# EAGLE design piezo-layer_v0.95-R006 (EAGLE 6.5.0)
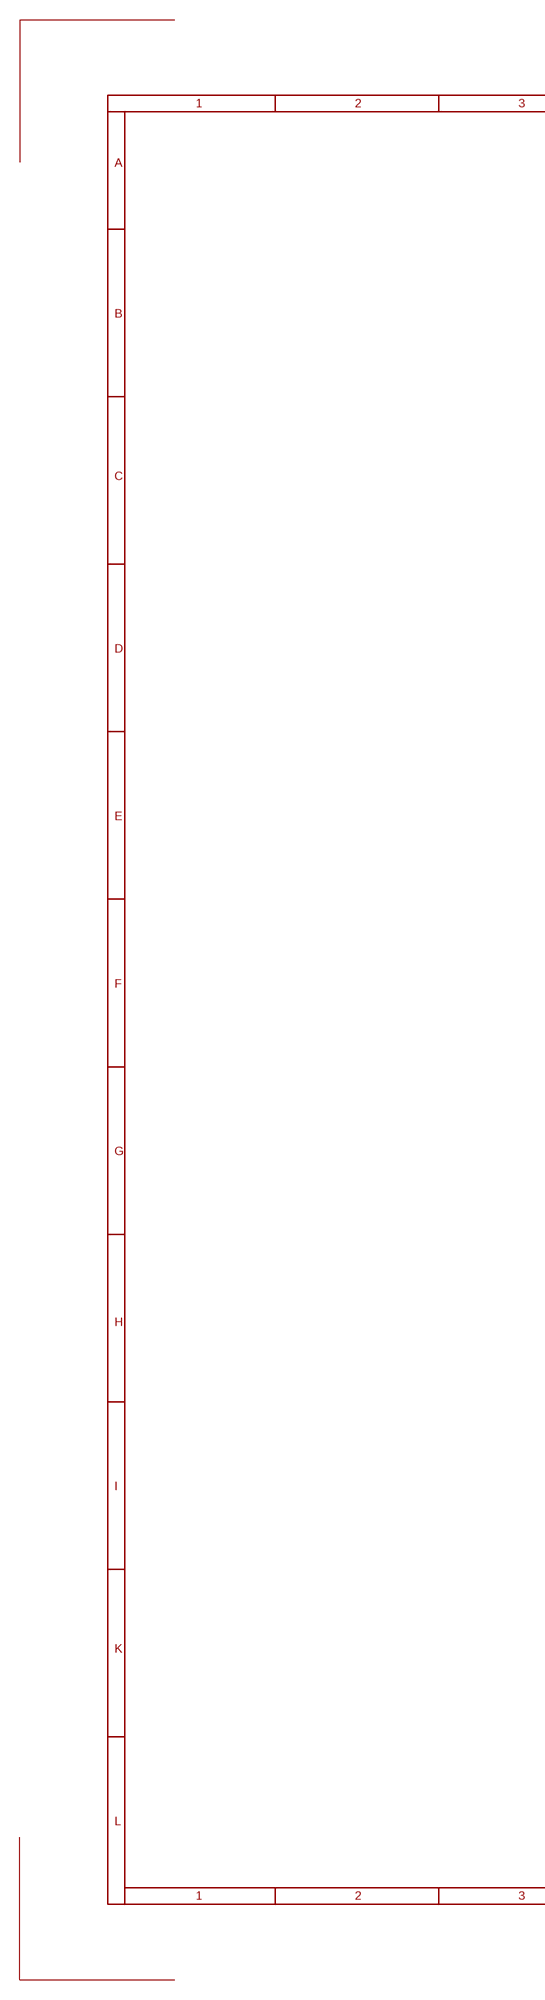
[diagram p0: schematic, sheet 1, part 1 of 2]
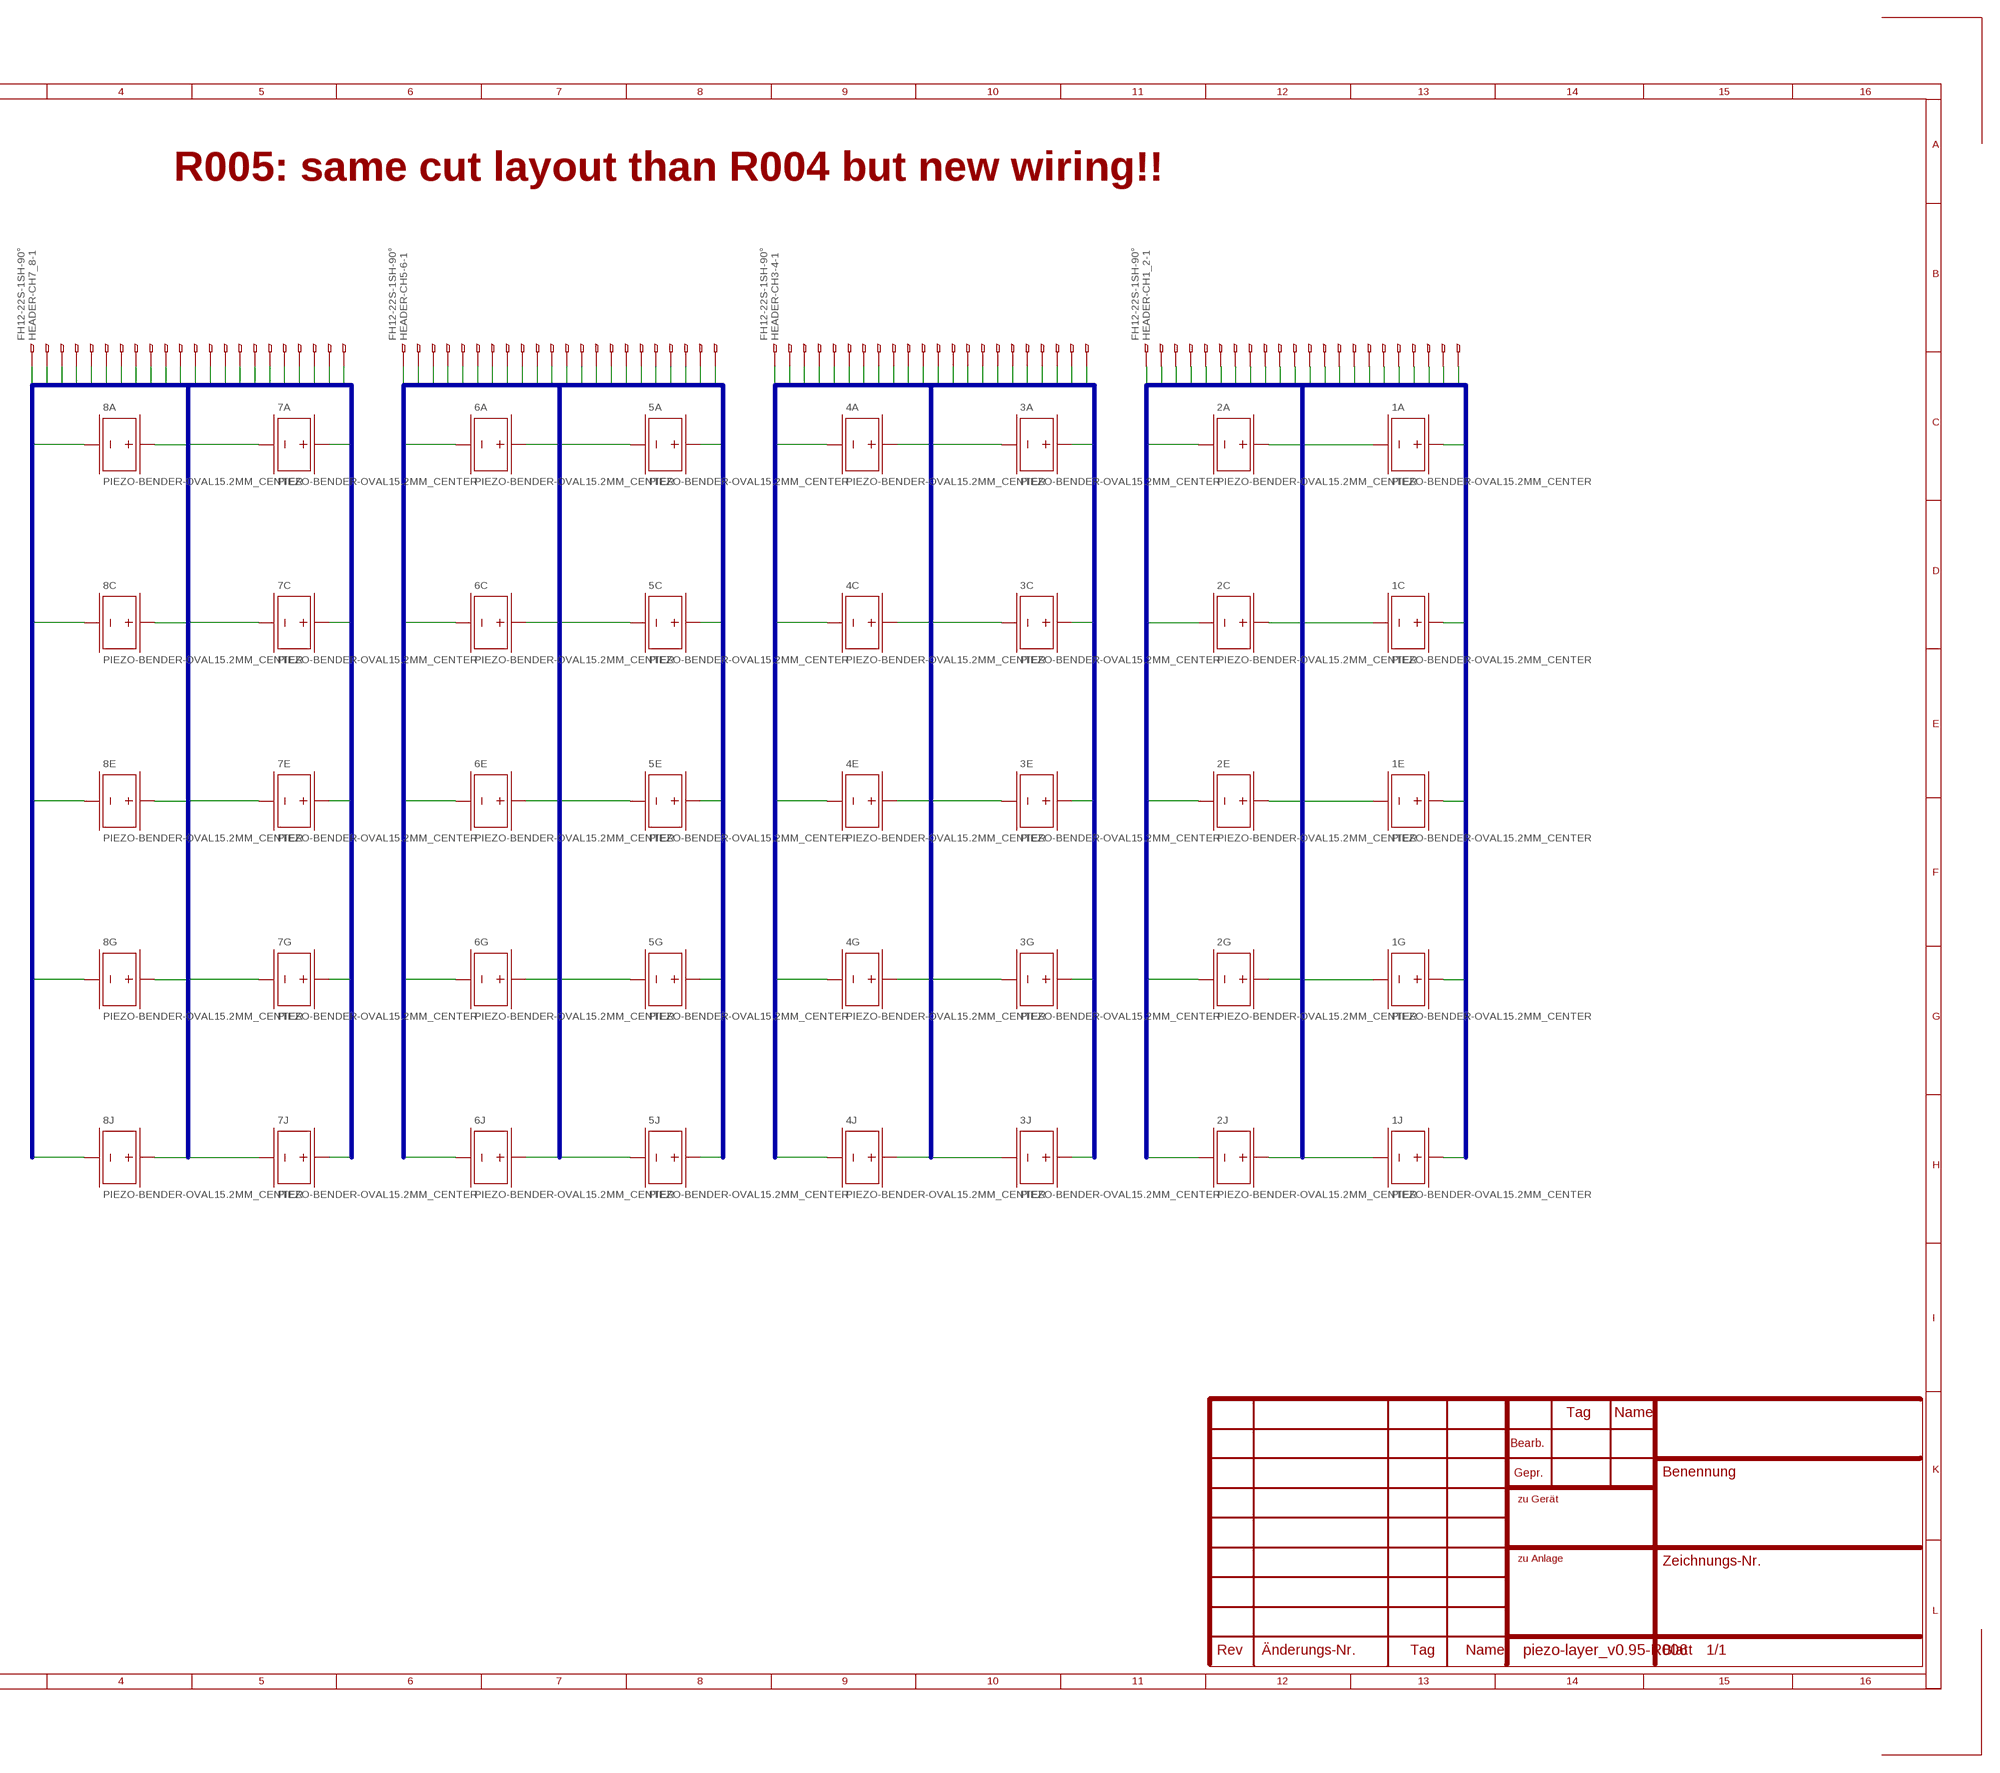
[diagram p1: schematic, sheet 1, part 2 of 2]

## Parts
1A  PIEZO-BENDER-OVAL15.2MM_CENTER  [PIEZO-BENDER-OVAL_15.2MM_BIGPADS_CENTER]
1C  PIEZO-BENDER-OVAL15.2MM_CENTER  [PIEZO-BENDER-OVAL_15.2MM_BIGPADS_CENTER]
1E  PIEZO-BENDER-OVAL15.2MM_CENTER  [PIEZO-BENDER-OVAL_15.2MM_BIGPADS_CENTER]
1G  PIEZO-BENDER-OVAL15.2MM_CENTER  [PIEZO-BENDER-OVAL_15.2MM_BIGPADS_CENTER]
1J  PIEZO-BENDER-OVAL15.2MM_CENTER  [PIEZO-BENDER-OVAL_15.2MM_BIGPADS_CENTER]
2A  PIEZO-BENDER-OVAL15.2MM_CENTER  [PIEZO-BENDER-OVAL_15.2MM_BIGPADS_CENTER]
2C  PIEZO-BENDER-OVAL15.2MM_CENTER  [PIEZO-BENDER-OVAL_15.2MM_BIGPADS_CENTER]
2E  PIEZO-BENDER-OVAL15.2MM_CENTER  [PIEZO-BENDER-OVAL_15.2MM_BIGPADS_CENTER]
2G  PIEZO-BENDER-OVAL15.2MM_CENTER  [PIEZO-BENDER-OVAL_15.2MM_BIGPADS_CENTER]
2J  PIEZO-BENDER-OVAL15.2MM_CENTER  [PIEZO-BENDER-OVAL_15.2MM_BIGPADS_CENTER]
3A  PIEZO-BENDER-OVAL15.2MM_CENTER  [PIEZO-BENDER-OVAL_15.2MM_BIGPADS_CENTER]
3C  PIEZO-BENDER-OVAL15.2MM_CENTER  [PIEZO-BENDER-OVAL_15.2MM_BIGPADS_CENTER]
3E  PIEZO-BENDER-OVAL15.2MM_CENTER  [PIEZO-BENDER-OVAL_15.2MM_BIGPADS_CENTER]
3G  PIEZO-BENDER-OVAL15.2MM_CENTER  [PIEZO-BENDER-OVAL_15.2MM_BIGPADS_CENTER]
3J  PIEZO-BENDER-OVAL15.2MM_CENTER  [PIEZO-BENDER-OVAL_15.2MM_BIGPADS_CENTER]
4A  PIEZO-BENDER-OVAL15.2MM_CENTER  [PIEZO-BENDER-OVAL_15.2MM_BIGPADS_CENTER]
4C  PIEZO-BENDER-OVAL15.2MM_CENTER  [PIEZO-BENDER-OVAL_15.2MM_BIGPADS_CENTER]
4E  PIEZO-BENDER-OVAL15.2MM_CENTER  [PIEZO-BENDER-OVAL_15.2MM_BIGPADS_CENTER]
4G  PIEZO-BENDER-OVAL15.2MM_CENTER  [PIEZO-BENDER-OVAL_15.2MM_BIGPADS_CENTER]
4J  PIEZO-BENDER-OVAL15.2MM_CENTER  [PIEZO-BENDER-OVAL_15.2MM_BIGPADS_CENTER]
5A  PIEZO-BENDER-OVAL15.2MM_CENTER  [PIEZO-BENDER-OVAL_15.2MM_BIGPADS_CENTER]
5C  PIEZO-BENDER-OVAL15.2MM_CENTER  [PIEZO-BENDER-OVAL_15.2MM_BIGPADS_CENTER]
5E  PIEZO-BENDER-OVAL15.2MM_CENTER  [PIEZO-BENDER-OVAL_15.2MM_BIGPADS_CENTER]
5G  PIEZO-BENDER-OVAL15.2MM_CENTER  [PIEZO-BENDER-OVAL_15.2MM_BIGPADS_CENTER]
5J  PIEZO-BENDER-OVAL15.2MM_CENTER  [PIEZO-BENDER-OVAL_15.2MM_BIGPADS_CENTER]
6A  PIEZO-BENDER-OVAL15.2MM_CENTER  [PIEZO-BENDER-OVAL_15.2MM_BIGPADS_CENTER]
6C  PIEZO-BENDER-OVAL15.2MM_CENTER  [PIEZO-BENDER-OVAL_15.2MM_BIGPADS_CENTER]
6E  PIEZO-BENDER-OVAL15.2MM_CENTER  [PIEZO-BENDER-OVAL_15.2MM_BIGPADS_CENTER]
6G  PIEZO-BENDER-OVAL15.2MM_CENTER  [PIEZO-BENDER-OVAL_15.2MM_BIGPADS_CENTER]
6J  PIEZO-BENDER-OVAL15.2MM_CENTER  [PIEZO-BENDER-OVAL_15.2MM_BIGPADS_CENTER]
7A  PIEZO-BENDER-OVAL15.2MM_CENTER  [PIEZO-BENDER-OVAL_15.2MM_BIGPADS_CENTER]
7C  PIEZO-BENDER-OVAL15.2MM_CENTER  [PIEZO-BENDER-OVAL_15.2MM_BIGPADS_CENTER]
7E  PIEZO-BENDER-OVAL15.2MM_CENTER  [PIEZO-BENDER-OVAL_15.2MM_BIGPADS_CENTER]
7G  PIEZO-BENDER-OVAL15.2MM_CENTER  [PIEZO-BENDER-OVAL_15.2MM_BIGPADS_CENTER]
7J  PIEZO-BENDER-OVAL15.2MM_CENTER  [PIEZO-BENDER-OVAL_15.2MM_BIGPADS_CENTER]
8A  PIEZO-BENDER-OVAL15.2MM_CENTER  [PIEZO-BENDER-OVAL_15.2MM_BIGPADS_CENTER]
8C  PIEZO-BENDER-OVAL15.2MM_CENTER  [PIEZO-BENDER-OVAL_15.2MM_BIGPADS_CENTER]
8E  PIEZO-BENDER-OVAL15.2MM_CENTER  [PIEZO-BENDER-OVAL_15.2MM_BIGPADS_CENTER]
8G  PIEZO-BENDER-OVAL15.2MM_CENTER  [PIEZO-BENDER-OVAL_15.2MM_BIGPADS_CENTER]
8J  PIEZO-BENDER-OVAL15.2MM_CENTER  [PIEZO-BENDER-OVAL_15.2MM_BIGPADS_CENTER]
HEADER-CH1_2  FH12-22S-1SH-90°  [FH12-22S-1SH]
HEADER-CH3-4  FH12-22S-1SH-90°  [FH12-22S-1SH]
HEADER-CH5-6  FH12-22S-1SH-90°  [FH12-22S-1SH]
HEADER-CH7_8  FH12-22S-1SH-90°  [FH12-22S-1SH]

## Nets
BUS1: 1J.TOP(+_1) HEADER-CH1_2.21
BUS2: HEADER-CH1_2.20
BUS3: 1G.TOP(+_1) HEADER-CH1_2.19
BUS4: HEADER-CH1_2.18
BUS5: 1A.BOTTOM(-_1) 1C.BOTTOM(-_1) 1E.BOTTOM(-_1) 1G.BOTTOM(-_1) 1J.BOTTOM(-_1) HEADER-CH1_2.16 HEADER-CH1_2.22
BUS6: 1E.TOP(+_1) HEADER-CH1_2.17
BUS7: HEADER-CH1_2.15
BUS8: 1C.TOP(+_1) HEADER-CH1_2.14
BUS9: HEADER-CH1_2.13
BUS10: 1A.TOP(+_1) HEADER-CH1_2.12
BUS11: 2J.TOP(+_1) HEADER-CH1_2.10
BUS12: HEADER-CH1_2.9
BUS13: 2G.TOP(+_1) HEADER-CH1_2.8
BUS14: HEADER-CH1_2.7
BUS15: 2A.BOTTOM(-_1) 2C.BOTTOM(-_1) 2E.BOTTOM(-_1) 2G.BOTTOM(-_1) 2J.BOTTOM(-_1) HEADER-CH1_2.5 HEADER-CH1_2.11
BUS16: 2E.TOP(+_1) HEADER-CH1_2.6
BUS17: HEADER-CH1_2.4
BUS18: 2C.TOP(+_1) HEADER-CH1_2.3
BUS19: HEADER-CH1_2.2
BUS20: 2A.TOP(+_1) HEADER-CH1_2.1
BUS21: 3J.TOP(+_1) HEADER-CH3-4.21
BUS22: HEADER-CH3-4.20
BUS23: 3G.TOP(+_1) HEADER-CH3-4.19
BUS24: HEADER-CH3-4.18
BUS25: 3A.BOTTOM(-_1) 3C.BOTTOM(-_1) 3E.BOTTOM(-_1) 3G.BOTTOM(-_1) 3J.BOTTOM(-_1) HEADER-CH3-4.16 HEADER-CH3-4.22
BUS26: 3E.TOP(+_1) HEADER-CH3-4.17
BUS27: HEADER-CH3-4.15
BUS28: 3C.TOP(+_1) HEADER-CH3-4.14
BUS29: HEADER-CH3-4.13
BUS30: 3A.TOP(+_1) HEADER-CH3-4.12
BUS31: 4J.TOP(+_1) HEADER-CH3-4.10
BUS32: HEADER-CH3-4.9
BUS33: 4G.TOP(+_1) HEADER-CH3-4.8
BUS34: HEADER-CH3-4.7
BUS35: 4A.BOTTOM(-_1) 4C.BOTTOM(-_1) 4E.BOTTOM(-_1) 4G.BOTTOM(-_1) 4J.BOTTOM(-_1) HEADER-CH3-4.5 HEADER-CH3-4.11
BUS36: 4E.TOP(+_1) HEADER-CH3-4.6
BUS37: HEADER-CH3-4.4
BUS38: 4C.TOP(+_1) HEADER-CH3-4.3
BUS39: HEADER-CH3-4.2
BUS40: 4A.TOP(+_1) HEADER-CH3-4.1
BUS41: 5J.TOP(+_1) HEADER-CH5-6.21
BUS42: HEADER-CH5-6.20
BUS43: 5G.TOP(+_1) HEADER-CH5-6.19
BUS44: HEADER-CH5-6.18
BUS45: 5A.BOTTOM(-_1) 5C.BOTTOM(-_1) 5E.BOTTOM(-_1) 5G.BOTTOM(-_1) 5J.BOTTOM(-_1) HEADER-CH5-6.16 HEADER-CH5-6.22
BUS46: 5E.TOP(+_1) HEADER-CH5-6.17
BUS47: HEADER-CH5-6.15
BUS48: 5C.TOP(+_1) HEADER-CH5-6.14
BUS49: HEADER-CH5-6.13
BUS50: 5A.TOP(+_1) HEADER-CH5-6.12
BUS51: 6J.TOP(+_1) HEADER-CH5-6.10
BUS52: HEADER-CH5-6.9
BUS53: 6G.TOP(+_1) HEADER-CH5-6.8
BUS54: HEADER-CH5-6.7
BUS55: 6A.BOTTOM(-_1) 6C.BOTTOM(-_1) 6E.BOTTOM(-_1) 6G.BOTTOM(-_1) 6J.BOTTOM(-_1) HEADER-CH5-6.5 HEADER-CH5-6.11
BUS56: 6E.TOP(+_1) HEADER-CH5-6.6
BUS57: HEADER-CH5-6.4
BUS58: 6C.TOP(+_1) HEADER-CH5-6.3
BUS59: HEADER-CH5-6.2
BUS60: 6A.TOP(+_1) HEADER-CH5-6.1
BUS61: 7J.TOP(+_1) HEADER-CH7_8.21
BUS62: HEADER-CH7_8.20
BUS63: 7G.TOP(+_1) HEADER-CH7_8.19
BUS64: HEADER-CH7_8.18
BUS65: 7A.BOTTOM(-_1) 7C.BOTTOM(-_1) 7E.BOTTOM(-_1) 7G.BOTTOM(-_1) 7J.BOTTOM(-_1) HEADER-CH7_8.16 HEADER-CH7_8.22
BUS66: 7E.TOP(+_1) HEADER-CH7_8.17
BUS67: HEADER-CH7_8.15
BUS68: 7C.TOP(+_1) HEADER-CH7_8.14
BUS69: HEADER-CH7_8.13
BUS70: 7A.TOP(+_1) HEADER-CH7_8.12
BUS71: 8J.TOP(+_1) HEADER-CH7_8.10
BUS72: HEADER-CH7_8.9
BUS73: 8G.TOP(+_1) HEADER-CH7_8.8
BUS74: HEADER-CH7_8.7
BUS75: 8A.BOTTOM(-_1) 8C.BOTTOM(-_1) 8E.BOTTOM(-_1) 8G.BOTTOM(-_1) 8J.BOTTOM(-_1) HEADER-CH7_8.5 HEADER-CH7_8.11
BUS76: 8E.TOP(+_1) HEADER-CH7_8.6
BUS77: HEADER-CH7_8.4
BUS78: 8C.TOP(+_1) HEADER-CH7_8.3
BUS79: HEADER-CH7_8.2
BUS80: 8A.TOP(+_1) HEADER-CH7_8.1

## Buses
BUS[1..20]
BUS[21..40]
BUS[41..60]
BUS[61..80]

## Notes on the sheet
- R005: same cut layout than R004 but new wiring!!

## Library data of the parts
1A 1C 1E 1G 1J 2A 2C 2E 2G 2J 3A 3C 3E 3G 3J 4A 4C 4E 4G 4J 5A 5C 5E 5G 5J 6A 6C 6E 6G 6J 7A 7C 7E 7G 7J 8A 8C 8E 8G 8J = ICST:PIEZO-BENDER-OVAL
HEADER-CH1_2 HEADER-CH3-4 HEADER-CH5-6 HEADER-CH7_8 = ICST:FH12-22S-1SH

## Board
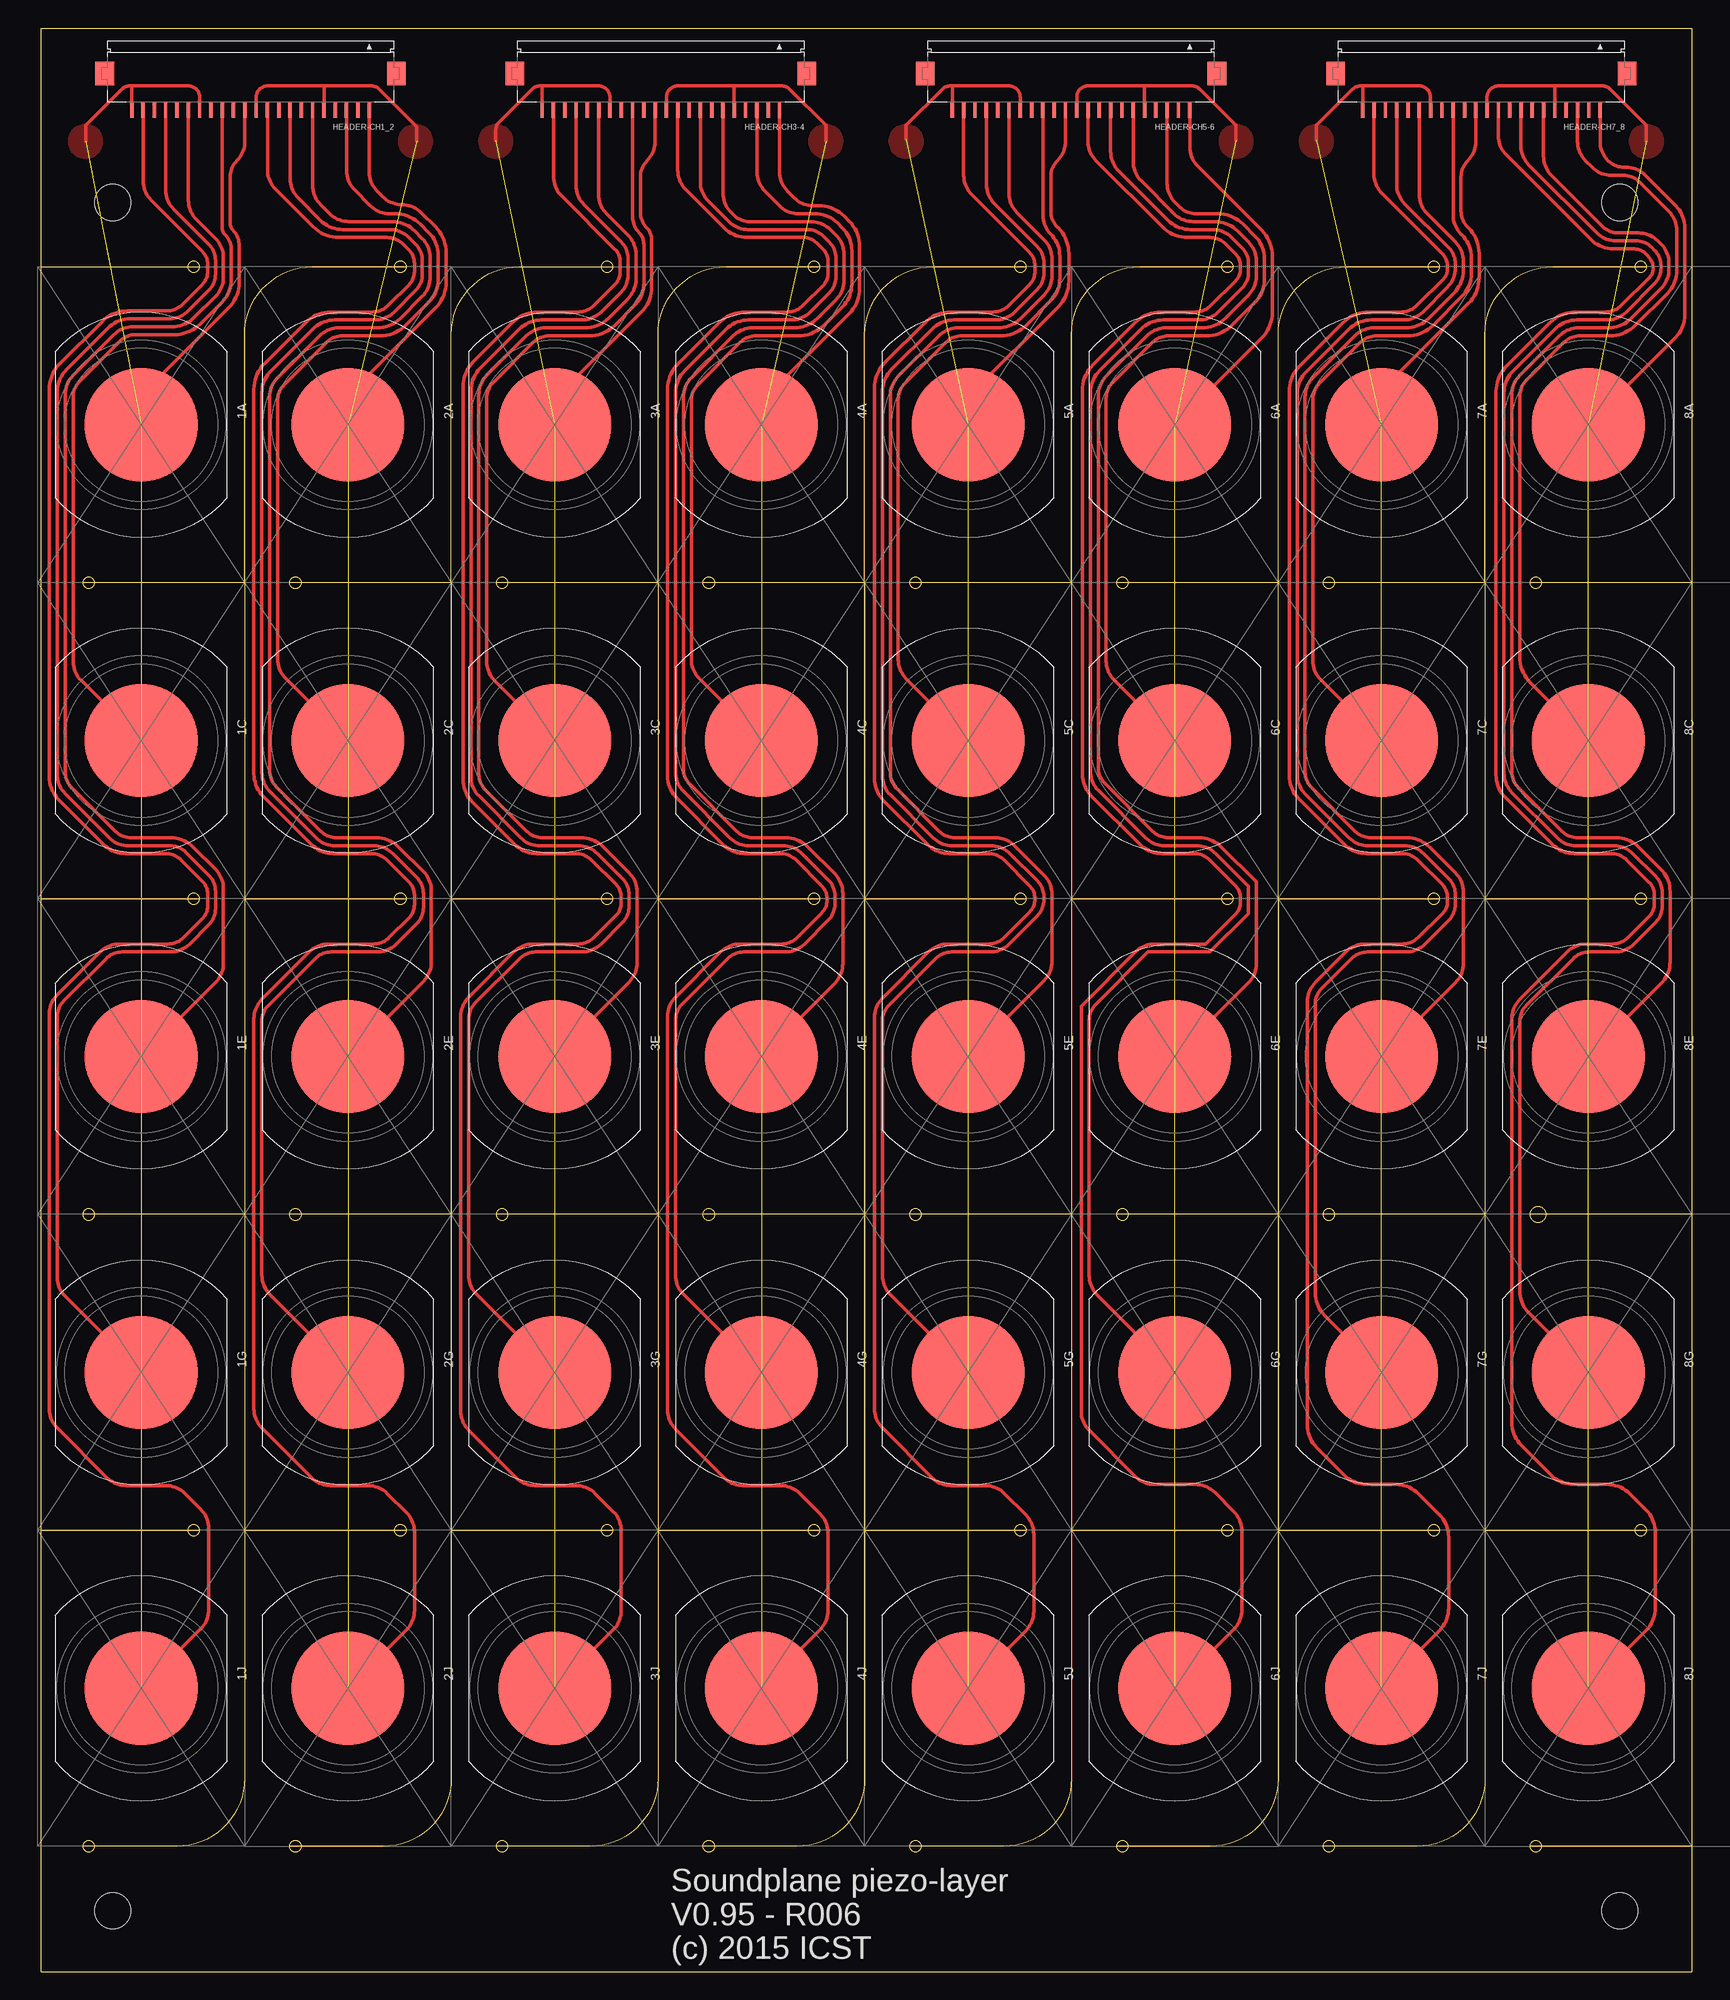
[diagram p2: board, top side]
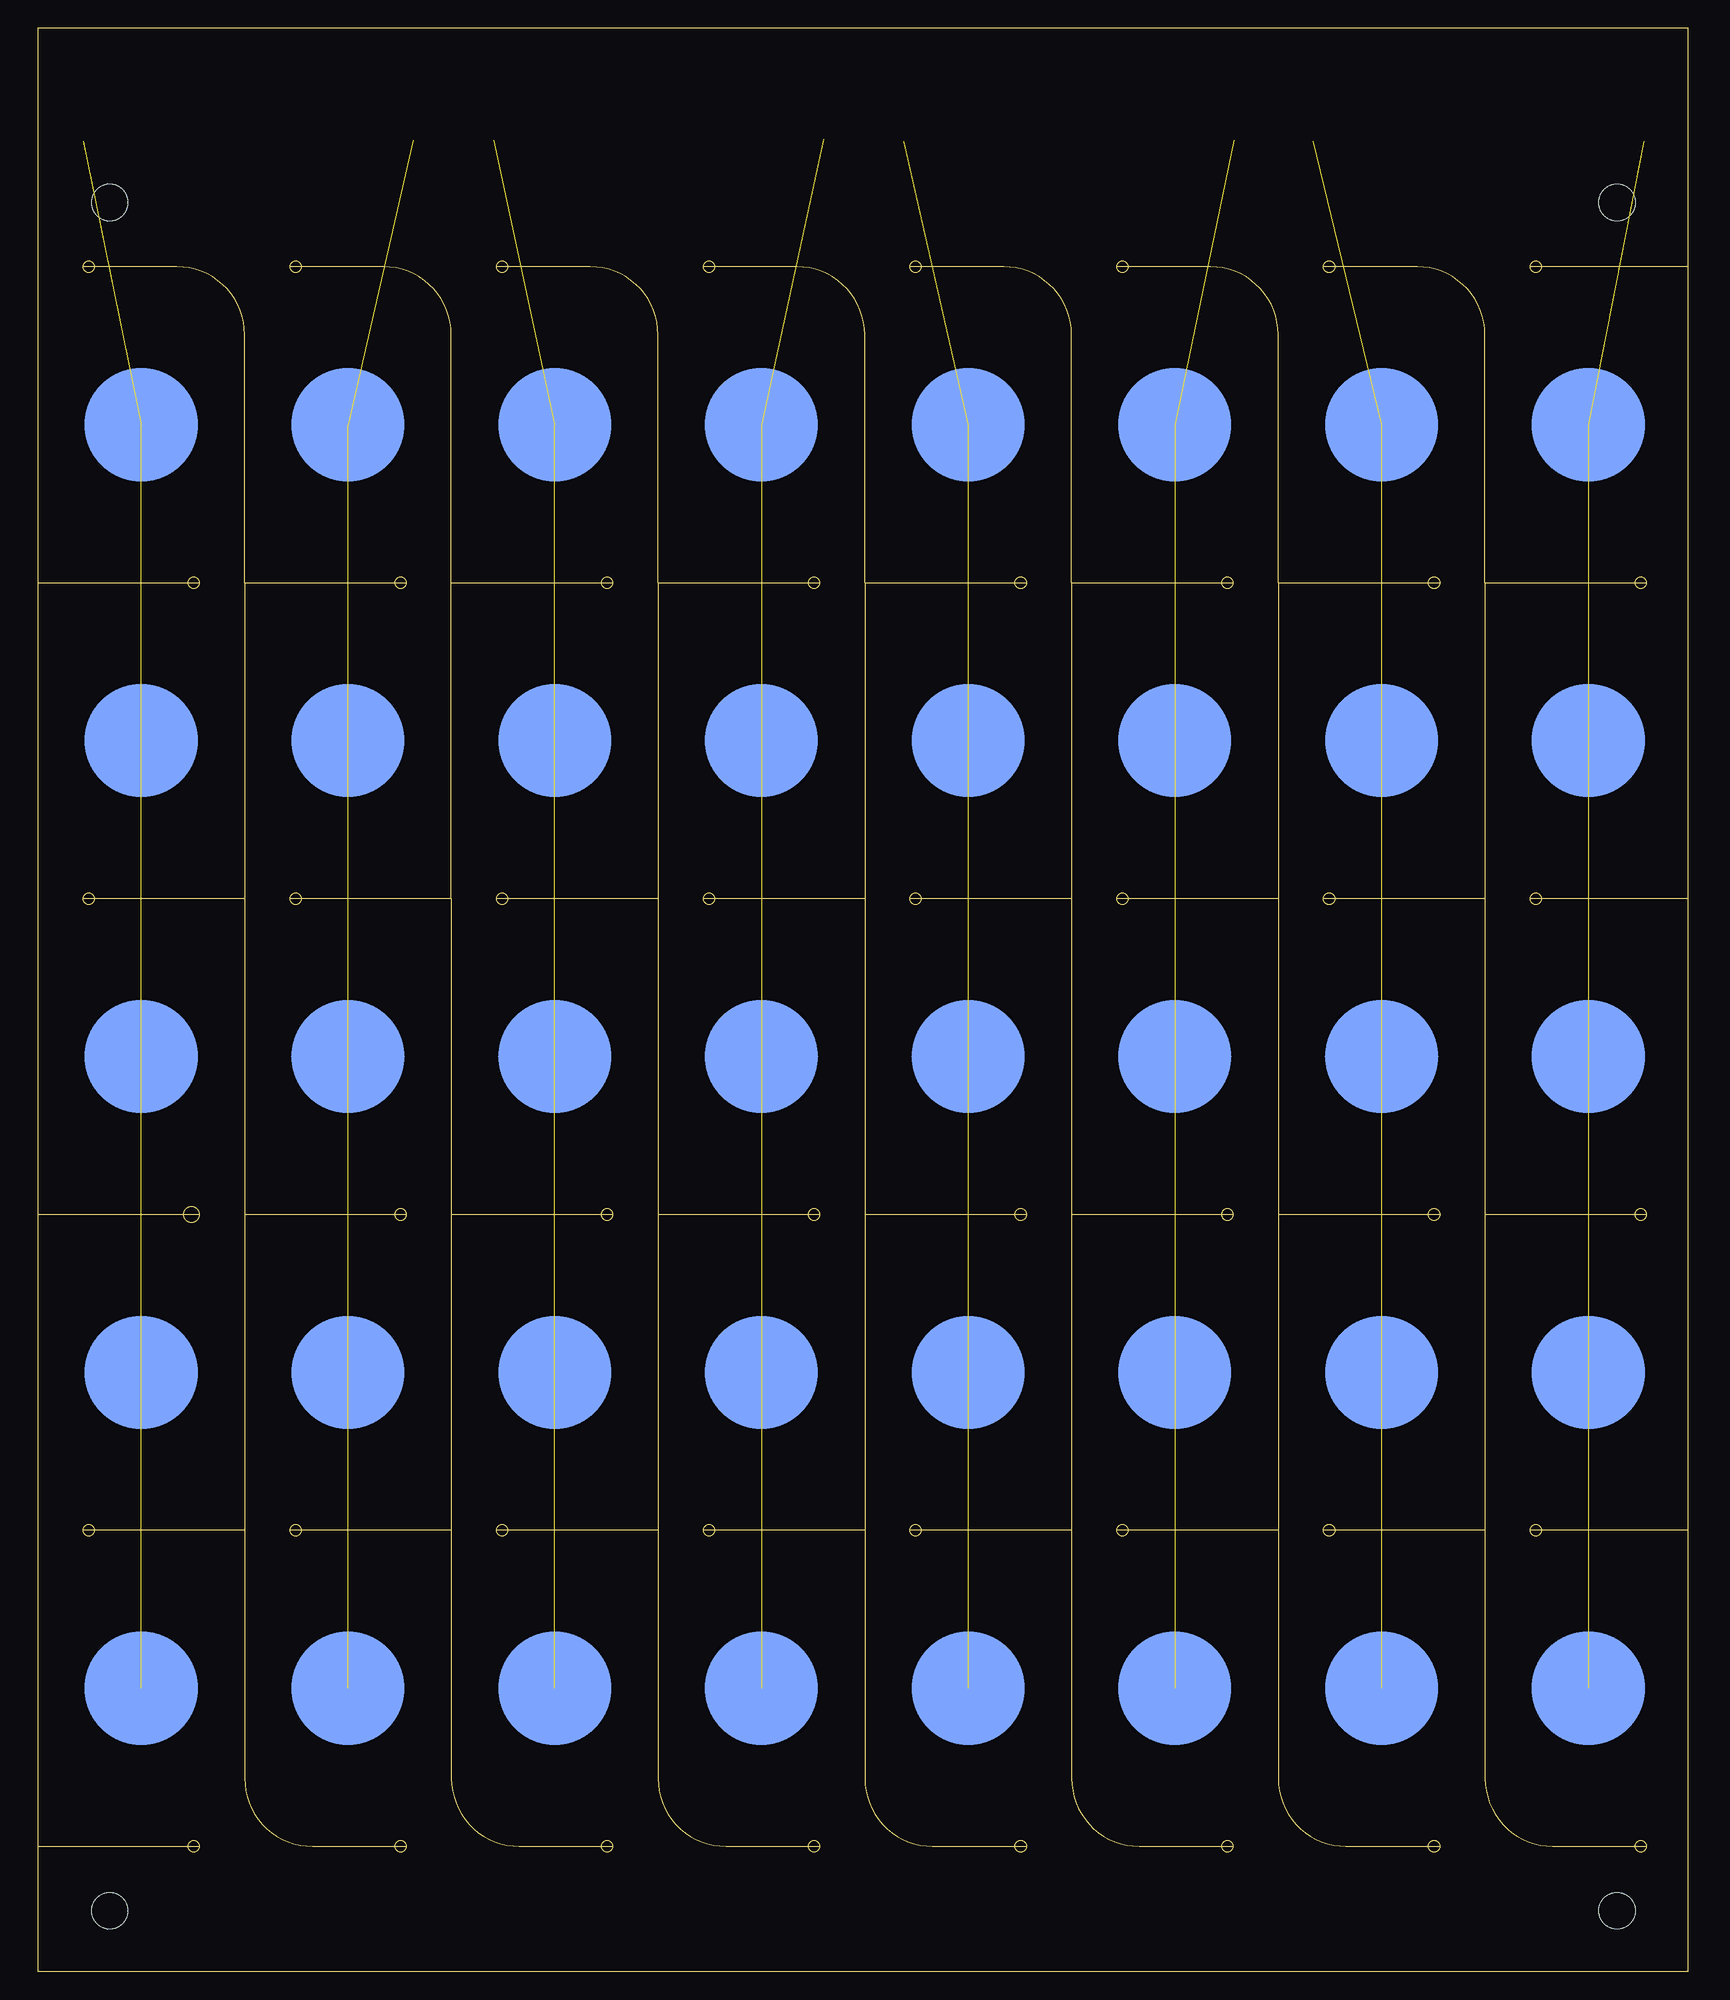
[diagram p3: board, bottom side, seen from below]

Size 146 x 171.9 mm. Coordinates in mm from the lower left corner, seen from the top.
Outline: 146,122.86 146,171.9 0,171.9 0,150.8
Outline: 146,122.86 146,66.98
Outline: 146,66.98 146,11.1
Outline: 146,11.1 146,0 0,0 0,39.04
Outline: 0,39.04 0,94.92
Outline: 0,94.92 0,150.8
Outline: 127.71,122.86 127.71,144.8 arc-90 133.71,150.8 142,150.8
Outline: 127.71,39.04 127.71,17.1 arc-90 121.71,11.1 113.42,11.1
Outline: 146,122.86 131.71,122.86
Outline: 146,66.98 131.71,66.98
Outline: 146,11.1 131.71,11.1
Outline: 127.71,39.04 142,39.04
Outline: 127.71,94.92 142,94.92
Outline: 109.42,94.92 109.42,122.86
Outline: 109.42,122.86 109.42,144.8 arc-90 115.42,150.8 123.71,150.8
Outline: 109.42,94.92 109.42,66.98
Outline: 109.42,66.98 109.42,39.04
Outline: 109.42,39.04 109.42,17.1 arc-90 103.42,11.1 95.13,11.1
Outline: 127.71,122.86 127.71,94.92
Outline: 127.71,94.92 127.71,66.98
Outline: 127.71,66.98 127.71,39.04
Outline: 127.71,122.86 113.42,122.86
Outline: 127.71,66.98 113.42,66.98
Outline: 109.42,39.04 123.71,39.04
Outline: 109.42,94.92 123.71,94.92
Outline: 91.13,122.86 91.13,144.8 arc-90 97.13,150.8 105.42,150.8
Outline: 91.13,122.86 91.13,94.92
Outline: 91.13,94.92 91.13,66.98
Outline: 91.13,66.98 91.13,39.04
Outline: 91.13,39.04 91.13,17.1 arc-90 85.13,11.1 76.84,11.1
Outline: 109.42,122.86 95.13,122.86
Outline: 109.42,66.98 95.13,66.98
Outline: 91.13,39.04 105.42,39.04
Outline: 91.13,94.92 105.42,94.92
Outline: 72.84,122.86 72.84,144.8 arc-90 78.84,150.8 87.13,150.8
Outline: 72.84,122.86 72.84,94.92
Outline: 72.84,94.92 72.84,66.98
Outline: 72.84,66.98 72.84,39.04
Outline: 72.84,39.04 72.84,17.1 arc-90 66.84,11.1 58.55,11.1
Outline: 91.13,122.86 76.84,122.86
Outline: 91.13,66.98 76.84,66.98
Outline: 72.84,39.04 87.13,39.04
Outline: 72.84,94.92 87.13,94.92
Outline: 54.55,122.86 54.55,144.8 arc-90 60.55,150.8 68.84,150.8
Outline: 54.55,122.86 54.55,94.92
Outline: 54.55,94.92 54.55,66.98
Outline: 54.55,66.98 54.55,39.04
Outline: 54.55,39.04 54.55,17.1 arc-90 48.55,11.1 40.26,11.1
Outline: 72.84,122.86 58.55,122.86
Outline: 72.84,66.98 58.55,66.98
Outline: 54.55,39.04 68.84,39.04
Outline: 54.55,94.92 68.84,94.92
Outline: 36.26,122.86 36.26,144.8 arc-90 42.26,150.8 50.55,150.8
Outline: 36.26,122.86 36.26,94.92
Outline: 36.26,94.92 36.26,66.98
Outline: 36.26,66.98 36.26,39.04
Outline: 36.26,39.04 36.26,17.1 arc-90 30.26,11.1 21.97,11.1
Outline: 54.55,122.86 40.26,122.86
Outline: 54.55,66.98 40.26,66.98
Outline: 36.26,39.04 50.55,39.04
Outline: 36.26,94.92 50.55,94.92
Outline: 17.97,122.86 17.97,144.8 arc-90 23.97,150.8 32.26,150.8
Outline: 17.97,122.86 17.97,94.92
Outline: 17.97,94.92 17.97,66.98
Outline: 17.97,66.98 17.97,39.04
Outline: 17.97,39.04 17.97,17.1 arc-90 11.97,11.1 3.68,11.1
Outline: 36.26,122.86 21.97,122.86
Outline: 36.26,66.98 21.97,66.98
Outline: 17.97,39.04 32.26,39.04
Outline: 17.97,94.92 32.26,94.92
Outline: 0,150.8 13.97,150.8
Outline: 17.97,122.86 3.68,122.86
Outline: 17.97,66.98 3.68,66.98
Outline: 0,39.04 13.97,39.04
Outline: 0,94.92 13.97,94.92
Outline: circle at 141.5,150.8 radius 0.5
Outline: circle at 132.21,122.86 radius 0.5
Outline: circle at 141.5,94.92 radius 0.5
Outline: circle at 132.41,66.98 radius 0.7
Outline: circle at 141.5,39.04 radius 0.5
Outline: circle at 132.21,11.1 radius 0.5
Outline: circle at 123.21,150.8 radius 0.5
Outline: circle at 113.92,122.86 radius 0.5
Outline: circle at 123.21,94.92 radius 0.5
Outline: circle at 113.92,66.98 radius 0.5
Outline: circle at 123.21,39.04 radius 0.5
Outline: circle at 113.92,11.1 radius 0.5
Outline: circle at 104.92,150.8 radius 0.5
Outline: circle at 86.63,150.8 radius 0.5
Outline: circle at 68.34,150.8 radius 0.5
Outline: circle at 50.05,150.8 radius 0.5
Outline: circle at 31.76,150.8 radius 0.5
Outline: circle at 13.47,150.8 radius 0.5
Outline: circle at 95.63,122.86 radius 0.5
Outline: circle at 77.34,122.86 radius 0.5
Copper layers 1*16: Top 0.018mm / dielectric 0.025mm / Bottom 0.018mm
Design rules "1L-0.025-0.15_0.3mm": minimum track width 0.15mm, minimum drill 0.3mm, track to track 0.15mm, track to pad 0.15mm, pad to pad 0.15mm, via to via 0.15mm, smd to smd 0.15mm, copper to edge 0.4mm, drill to drill 1mm, minimum pad ring 10mil, minimum via ring 8mil, stop-mask expansion 4mil, vias tented up to drill 0mil, thermal gap 10mil
Holes 3.2 mm at 139.65,156.5 6.3,156.5 139.65,5.4 6.3,5.4

### Footprints (pad centres in the part's own frame; a part is rotated, then mirrored left to right if it is on the bottom)
PIEZO-BENDER-OVAL_15.2MM_BIGPADS_CENTER = smd 10 x 10 bottom: BOTTOM 0,0 | smd 10 x 10: TOP 0,0
FH12-22S-1SH = smd 0.3 x 1.3: 1 -10.5,3.25; 2 -9.5,3.25; 3 -8.5,3.25; 4 -7.5,3.25; 5 -6.5,3.25; 6 -5.5,3.25; 7 -4.5,3.25; 8 -3.5,3.25; 9 -2.5,3.25; 10 -1.5,3.25; 11 -0.5,3.25; 12 0.5,3.25; 13 1.5,3.25; 14 2.5,3.25; 15 3.5,3.25; 16 4.5,3.25; 17 5.5,3.25; 18 6.5,3.25; 19 7.5,3.25; 20 8.5,3.25; 21 9.5,3.25; 22 10.5,3.25 | smd 1.65 x 2.05: PAD1 -12.9,0; PAD2 12.9,0

### Placement (x,y rotation side)
1A  8.83,136.83 270 top
1C  8.83,108.89 270 top
1E  8.83,80.95 270 top
1G  8.83,53.01 270 top
1J  8.83,25.07 270 top
2A  27.12,136.83 270 top
2C  27.12,108.89 270 top
2E  27.12,80.95 270 top
2G  27.12,53.01 270 top
2J  27.12,25.07 270 top
3A  45.41,136.83 270 top
3C  45.41,108.89 270 top
3E  45.41,80.95 270 top
3G  45.41,53.01 270 top
3J  45.41,25.07 270 top
4A  63.7,136.83 270 top
4C  63.7,108.89 270 top
4E  63.7,80.95 270 top
4G  63.7,53.01 270 top
4J  63.7,25.07 270 top
5A  81.99,136.83 270 top
5C  81.99,108.89 270 top
5E  81.99,80.95 270 top
5G  81.99,53.01 270 top
5J  81.99,25.07 270 top
6A  100.28,136.83 270 top
6C  100.28,108.89 270 top
6E  100.28,80.95 270 top
6G  100.28,53.01 270 top
6J  100.28,25.07 270 top
7A  118.57,136.83 270 top
7C  118.57,108.89 270 top
7E  118.57,80.95 270 top
7G  118.57,53.01 270 top
7J  118.57,25.07 270 top
8A  136.86,136.83 270 top
8C  136.86,108.89 270 top
8E  136.86,80.95 270 top
8G  136.86,53.01 270 top
8J  136.86,25.07 270 top
HEADER-CH1_2  18.5,167.9 180 top
HEADER-CH3-4  54.8,167.9 180 top
HEADER-CH5-6  91.1,167.9 180 top
HEADER-CH7_8  127.4,167.9 180 top

### Tracks (layer width: path | path; a pad name or v marks a point on that pad's centre or on a via)
BUS1
  Top 0.3: 1J.TOP 14.1,30.34 arc45 14.8,32.03 14.8,39.21 arc45 14.1,40.9 12.7,42.3 arc45 11.01,43 7.49,43 arc-45 5.8,43.7 1.4,48.1 arc-45 0.7,49.79 0.7,84.71 arc-45 1.4,86.4 5.2,90.2 arc-45 6.89,90.9 11.17,90.9 arc45 12.59,91.49 14.23,93.13 arc45 14.7,94.26 14.7,95.34 arc45 14.23,96.47 12.39,98.31 arc45 10.97,98.9 7.46,98.9 arc-45 5.48,99.72 1.52,103.68 arc-45 0.7,105.66 0.7,139.97 arc-45 1.64,142.24 5.36,145.96 arc-45 7.62,146.9 11.07,146.9 arc45 12.49,147.49 14.23,149.23 arc45 14.7,150.36 14.7,151.04 arc45 14.23,152.17 9.7,156.7 arc-45 9,158.39 HEADER-CH1_2.21
BUS3
  Top 0.3: 1G.TOP 2.1,59.74 arc-45 1.4,61.43 1.4,84.47 arc-45 1.99,85.89 5.71,89.61 arc-45 7.13,90.2 11.41,90.2 arc45 13.1,90.9 14.81,92.61 arc45 15.4,94.03 15.4,95.57 arc45 14.81,96.99 12.79,99.01 arc45 11.37,99.6 7.69,99.6 arc-45 6,100.3 2.1,104.2 arc-45 1.4,105.89 1.4,139.74 arc-45 2.22,141.72 5.88,145.38 arc-45 7.86,146.2 11.31,146.2 arc45 13,146.9 14.81,148.71 arc45 15.4,150.13 15.4,151.37 arc45 14.81,152.79 11.7,155.9 arc-45 11,157.59 HEADER-CH1_2.19
BUS5  (5 unrouted)
  Top 0.3: HEADER-CH1_2.16 14,165.8 arc90 13,166.8 8,166.8 | 8,166.8 7.81,166.8 arc45 7.11,166.51 3.9,163.3 3.9,161.9 | HEADER-CH1_2.22 8,166.8
  pour Top: 3.9,163.4 arc-90 5.4,161.9 arc-90 3.9,160.4 arc-90 2.4,161.9 arc-90
BUS6
  Top 0.3: 1E.TOP 15.4,87.52 arc45 16.1,89.21 16.1,95.81 arc45 15.4,97.5 13.42,99.48 arc45 11.44,100.3 7.93,100.3 arc-45 6.51,100.89 2.69,104.71 arc-45 2.1,106.13 2.1,139.51 arc-45 2.8,141.2 6.4,144.8 arc-45 8.09,145.5 11.54,145.5 arc45 13.52,146.32 15.4,148.2 arc45 16.1,149.89 16.1,151.61 arc45 15.4,153.3 13.7,155 arc-45 13,156.69 HEADER-CH1_2.17
BUS8
  Top 0.3: HEADER-CH1_2.14 16,154.2 arc45 16.21,153.69 arc-45 16.8,152.27 16.8,149.66 arc-45 15.98,147.68 14.04,145.74 arc-45 11.78,144.8 8.33,144.8 arc45 6.91,144.21 3.39,140.69 arc45 2.8,139.27 2.8,115.91 arc45 3.5,114.22 1C.TOP
BUS10
  Top 0.3: 1A.TOP 8.83,139.43 16.56,147.16 arc45 17.5,149.43 17.5,152.67 arc45 16.91,154.09 arc-45 16.7,154.6 16.7,158.76 arc-45 17.3,160.2 arc45 18,161.89 HEADER-CH1_2.12
BUS11
  Top 0.3: 2J.TOP 32.3,30.25 arc45 33,31.94 33,38.91 arc45 32.3,40.6 30.6,42.3 arc45 28.91,43 25.59,43 arc-45 23.9,43.7 19.5,48.1 arc-45 18.8,49.79 18.8,84.31 arc-45 19.5,86 23.7,90.2 arc-45 25.39,90.9 29.37,90.9 arc45 30.79,91.49 32.53,93.23 arc45 33,94.36 33,95.24 arc45 32.53,96.37 30.59,98.31 arc45 29.17,98.9 25.86,98.9 arc-45 23.88,99.72 19.62,103.98 arc-45 18.8,105.96 18.8,139.97 arc-45 19.74,142.24 23.36,145.86 arc-45 25.62,146.8 29.27,146.8 arc45 30.69,147.39 32.53,149.23 arc45 33,150.36 33,151.14 arc45 32.53,152.27 31.99,152.81 arc45 30.57,153.4 26.32,153.4 arc-45 24.06,154.34 20.7,157.7 arc-45 20,159.39 HEADER-CH1_2.10
BUS13
  Top 0.3: 2G.TOP 20.2,59.93 arc-45 19.5,61.62 19.5,84.07 arc-45 20.09,85.49 24.21,89.61 arc-45 25.63,90.2 29.71,90.2 arc45 31.4,90.9 33.21,92.71 arc45 33.8,94.13 33.8,95.37 arc45 33.21,96.79 31.1,98.9 arc45 29.41,99.6 25.99,99.6 arc-45 24.3,100.3 20.2,104.4 arc-45 19.5,106.09 19.5,139.64 arc-45 20.32,141.62 23.98,145.28 arc-45 25.96,146.1 29.51,146.1 arc45 31.2,146.8 33.11,148.71 arc45 33.7,150.13 33.7,151.37 arc45 33.11,152.79 32.5,153.4 arc45 30.81,154.1 26.66,154.1 arc-45 24.68,154.92 22.7,156.9 arc-45 22,158.59 HEADER-CH1_2.8
BUS15  (5 unrouted)
  Top 0.3: HEADER-CH1_2.11 19,165.8 arc-90 20,166.8 25,166.8 | 25,166.8 29.19,166.8 arc-45 29.89,166.51 33.2,163.2 33.2,161.9 | HEADER-CH1_2.5 25,166.8
  pour Top: 33.1,160.4 arc-90 31.6,161.9 arc-90 33.1,163.4 arc-90 34.6,161.9 arc-90
BUS16
  Top 0.3: 2E.TOP 33.8,87.63 arc45 34.5,89.32 34.5,95.61 arc45 33.8,97.3 31.62,99.48 arc45 29.64,100.3 26.13,100.3 arc-45 24.71,100.89 20.79,104.81 arc-45 20.2,106.23 20.2,139.31 arc-45 20.9,141 24.6,144.7 arc-45 26.29,145.4 29.74,145.4 arc45 31.72,146.22 33.7,148.2 arc45 34.4,149.89 34.4,151.61 arc45 33.7,153.3 33.02,153.98 arc45 31.04,154.8 27.19,154.8 arc-45 25.5,155.5 24.7,156.3 arc-45 24,157.99 HEADER-CH1_2.6
BUS18
  Top 0.3: 2C.TOP 21.6,114.41 arc-45 20.9,116.1 20.9,138.97 arc-45 21.49,140.39 25.21,144.11 arc-45 26.63,144.7 29.98,144.7 arc45 32.24,145.64 34.28,147.68 arc45 35.1,149.66 35.1,151.84 arc45 34.28,153.82 33.54,154.56 arc45 31.27,155.5 30.79,155.5 arc-45 29.1,156.2 27.7,157.6 arc-45 27,159.29 HEADER-CH1_2.3
BUS20
  Top 0.3: 2A.TOP 27.12,139.42 34.86,147.16 arc45 35.8,149.43 35.8,152.08 arc45 34.86,154.34 33.61,155.59 arc45 31.89,156.3 arc-45 30.2,157 29.7,157.5 arc-45 29,159.19 HEADER-CH1_2.1
BUS21
  Top 0.3: 3J.TOP 50.6,30.26 arc45 51.3,31.95 51.3,39.01 arc45 50.6,40.7 49,42.3 arc45 47.31,43 43.69,43 arc-45 42,43.7 37.8,47.9 arc-45 37.1,49.59 37.1,84.51 arc-45 37.8,86.2 41.8,90.2 arc-45 43.49,90.9 47.47,90.9 arc45 48.89,91.49 50.83,93.43 arc45 51.3,94.56 51.3,95.04 arc45 50.83,96.17 48.69,98.31 arc45 47.27,98.9 43.86,98.9 arc-45 41.88,99.72 38.12,103.48 arc-45 37.3,105.46 37.3,140.18 arc-45 38.24,142.44 41.66,145.86 arc-45 43.92,146.8 47.47,146.8 arc45 48.89,147.39 50.73,149.23 arc45 51.2,150.36 51.2,151.24 arc45 50.73,152.37 46,157.1 arc-45 45.3,158.79 HEADER-CH3-4.21
BUS23
  Top 0.3: 3G.TOP 38.5,59.92 arc-45 37.8,61.61 37.8,84.27 arc-45 38.39,85.69 42.31,89.61 arc-45 43.73,90.2 47.81,90.2 arc45 49.5,90.9 51.41,92.81 arc45 52,94.23 52,95.27 arc45 51.41,96.69 49.2,98.9 arc45 47.51,99.6 44.09,99.6 arc-45 42.4,100.3 38.7,104 arc-45 38,105.69 38,139.84 arc-45 38.82,141.82 42.28,145.28 arc-45 44.26,146.1 47.81,146.1 arc45 49.5,146.8 51.31,148.61 arc45 51.9,150.03 51.9,151.57 arc45 51.31,152.99 48,156.3 arc-45 47.3,157.99 HEADER-CH3-4.19
BUS25  (5 unrouted)
  Top 0.3: HEADER-CH3-4.16 50.3,165.8 arc90 49.3,166.8 44.3,166.8 | 44.3,166.8 44.11,166.8 arc45 43.41,166.51 40.49,163.59 arc45 40.2,162.89 40.2,162 | HEADER-CH3-4.22 44.3,166.8
  pour Top: 40.2,163.4 arc-90 41.7,161.9 arc-90 40.2,160.4 arc-90 38.7,161.9 arc-90
BUS26
  Top 0.3: 3E.TOP 52,87.54 arc45 52.7,89.23 52.7,95.51 arc45 52,97.2 49.72,99.48 arc45 47.74,100.3 44.33,100.3 arc-45 42.91,100.89 39.29,104.51 arc-45 38.7,105.93 38.7,139.51 arc-45 39.4,141.2 42.9,144.7 arc-45 44.59,145.4 48.14,145.4 arc45 50.12,146.22 51.9,148 arc45 52.6,149.69 52.6,151.91 arc45 51.9,153.6 50,155.5 arc-45 49.3,157.19 HEADER-CH3-4.17
BUS28
  Top 0.3: 3C.TOP 40.1,114.2 arc-45 39.4,115.89 39.4,139.17 arc-45 39.99,140.59 43.51,144.11 arc-45 44.93,144.7 48.48,144.7 arc45 50.74,145.64 52.48,147.38 arc45 53.3,149.36 53.3,152.81 arc45 52.89,153.81 arc-45 52.3,155.23 HEADER-CH3-4.14
BUS30
  Top 0.3: 3A.TOP 45.41,139.11 53.06,146.76 arc45 54,149.03 54,153.21 arc45 53.59,154.21 arc-45 53,155.63 53,158.76 arc-45 53.6,160.2 arc45 54.3,161.89 HEADER-CH3-4.12
BUS31
  Top 0.3: 4J.TOP 68.9,30.27 arc45 69.6,31.96 69.6,38.81 arc45 68.9,40.5 67.1,42.3 arc45 65.41,43 62.09,43 arc-45 60.4,43.7 56.1,48 arc-45 55.4,49.69 55.4,84.51 arc-45 56.1,86.2 60.1,90.2 arc-45 61.79,90.9 65.47,90.9 arc45 66.89,91.49 69.03,93.63 arc45 69.5,94.76 69.5,94.94 arc45 69.03,96.07 66.79,98.31 arc45 65.37,98.9 62.26,98.9 arc-45 60.28,99.72 56.22,103.78 arc-45 55.4,105.76 55.4,139.97 arc-45 56.34,142.24 59.96,145.86 arc-45 62.23,146.8 65.97,146.8 arc45 67.39,147.39 69.13,149.13 arc45 69.6,150.26 69.6,151.24 arc45 69.13,152.37 68.57,152.93 arc45 67.44,153.4 62.42,153.4 arc-45 60.44,154.22 57,157.66 arc-45 56.3,159.35 HEADER-CH3-4.10
BUS33
  Top 0.3: HEADER-CH3-4.8 58.3,158.32 arc45 59,156.62 60.82,154.8 arc45 62.52,154.1 67.77,154.1 arc-45 69.19,153.51 69.71,152.99 arc-45 70.3,151.57 70.3,149.93 arc-45 69.71,148.51 68,146.8 arc-45 66.31,146.1 62.56,146.1 arc45 60.58,145.28 56.92,141.62 arc45 56.1,139.64 56.1,106.09 arc45 56.8,104.4 60.9,100.3 arc45 62.59,99.6 65.61,99.6 arc-45 67.3,98.9 69.61,96.59 arc-45 70.2,95.17 70.2,94.43 arc-45 69.61,93.01 67.5,90.9 arc-45 65.81,90.2 62.13,90.2 arc45 60.71,89.61 56.69,85.59 arc45 56.1,84.17 56.1,61.6 arc45 56.8,59.91 4G.TOP
BUS35  (5 unrouted)
  Top 0.3: HEADER-CH3-4.11 55.3,165.8 arc-90 56.3,166.8 61.3,166.8 | 61.3,166.8 65.49,166.8 arc-45 66.19,166.51 69.4,163.3 69.4,161.9 | HEADER-CH3-4.5 61.3,166.8
  pour Top: 69.4,160.4 arc-90 67.9,161.9 arc-90 69.4,163.4 arc-90 70.9,161.9 arc-90
BUS36
  Top 0.3: HEADER-CH3-4.6 60.3,157.32 arc45 61,155.62 61.24,155.39 arc45 62.66,154.8 68.11,154.8 arc-45 69.8,154.1 70.3,153.6 arc-45 71,151.91 71,149.59 arc-45 70.3,147.9 68.62,146.22 arc-45 66.64,145.4 62.89,145.4 arc45 61.2,144.7 57.5,141 arc45 56.8,139.31 56.8,106.43 arc45 57.39,105.01 61.51,100.89 arc45 62.93,100.3 65.84,100.3 arc-45 67.82,99.48 70.2,97.1 arc-45 70.9,95.41 70.9,89.14 arc-45 70.2,87.45 4E.TOP
BUS38
  Top 0.3: 4C.TOP 58.2,114.39 arc-45 57.5,116.08 57.5,138.97 arc-45 58.09,140.39 61.81,144.11 arc-45 63.23,144.7 66.97,144.7 arc45 69.24,145.64 70.88,147.28 arc45 71.7,149.26 71.7,152.24 arc45 70.88,154.22 70.42,154.68 arc45 68.44,155.5 66.99,155.5 arc-45 65.3,156.2 64,157.5 arc-45 63.3,159.19 HEADER-CH3-4.3
BUS40
  Top 0.3: 4A.TOP 63.7,138.9 71.46,146.66 arc45 72.4,148.93 72.4,152.58 arc45 71.46,154.84 71.04,155.26 arc45 68.78,156.2 68.29,156.2 arc-45 66.6,156.9 66,157.5 arc-45 65.3,159.19 HEADER-CH3-4.1
BUS41
  Top 0.3: 5J.TOP 87.1,30.18 arc45 87.8,31.87 87.8,38.71 arc45 87.1,40.4 85.2,42.3 arc45 83.51,43 80.49,43 arc-45 78.8,43.7 74.4,48.1 arc-45 73.7,49.79 73.7,84.41 arc-45 74.4,86.1 78.5,90.2 arc-45 80.19,90.9 83.77,90.9 arc45 85.19,91.49 87.43,93.73 arc45 87.9,94.86 87.9,94.94 arc45 87.43,96.07 85.19,98.31 arc45 83.77,98.9 80.36,98.9 arc-45 78.38,99.72 74.52,103.58 arc-45 73.7,105.56 73.7,140.08 arc-45 74.64,142.34 78.16,145.86 arc-45 80.42,146.8 84.17,146.8 arc45 85.59,147.39 87.43,149.23 arc45 87.9,150.36 87.9,150.94 arc45 87.43,152.07 82.3,157.2 arc-45 81.6,158.89 HEADER-CH5-6.21
BUS43
  Top 0.3: 5G.TOP 75.1,59.9 arc-45 74.4,61.59 74.4,84.07 arc-45 74.99,85.49 79.11,89.61 arc-45 80.53,90.2 83.91,90.2 arc45 85.6,90.9 88.11,93.41 arc45 88.7,94.83 88.7,95.07 arc45 88.11,96.49 85.7,98.9 arc45 84.01,99.6 80.59,99.6 arc-45 78.9,100.3 75.1,104.1 arc-45 74.4,105.79 74.4,139.74 arc-45 75.22,141.72 78.78,145.28 arc-45 80.76,146.1 84.41,146.1 arc45 86.1,146.8 88.11,148.81 arc45 88.7,150.23 88.7,151.17 arc45 88.11,152.59 84.3,156.4 arc-45 83.6,158.09 HEADER-CH5-6.19
BUS45  (5 unrouted)
  Top 0.3: HEADER-CH5-6.16 86.6,165.8 arc90 85.6,166.8 80.6,166.8 | 80.6,166.8 80.41,166.8 arc45 79.71,166.51 76.5,163.3 76.5,162.1 | HEADER-CH5-6.22 80.6,166.8
  pour Top: 76.5,163.4 arc-90 78,161.9 arc-90 76.5,160.4 arc-90 75,161.9 arc-90
BUS46
  Top 0.3: 5E.TOP 88.7,87.66 arc45 89.4,89.35 89.4,95.31 arc45 88.7,97 86.1,99.6 arc45 84.41,100.3 80.83,100.3 arc-45 79.41,100.89 75.69,104.61 arc-45 75.1,106.03 75.1,139.41 arc-45 75.8,141.1 79.4,144.7 arc-45 81.09,145.4 84.64,145.4 arc45 86.62,146.22 88.7,148.3 arc45 89.4,149.99 89.4,151.51 arc45 88.7,153.2 86.3,155.6 arc-45 85.6,157.29 HEADER-CH5-6.17
BUS48
  Top 0.3: 5C.TOP 76.5,114.38 arc-45 75.8,116.07 75.8,139.07 arc-45 76.39,140.49 80.01,144.11 arc-45 81.43,144.7 84.88,144.7 arc45 87.14,145.64 89.28,147.78 arc45 90.1,149.76 90.1,151.74 arc45 89.28,153.72 arc-45 88.6,155.36 HEADER-CH5-6.14
BUS50
  Top 0.3: 5A.TOP arc45 82.3,137.58 82.3,139.6 89.96,147.26 arc45 90.9,149.53 90.9,151.97 arc45 89.96,154.24 89.89,154.31 arc-45 89.3,155.73 89.3,158.76 arc-45 89.9,160.2 arc45 90.6,161.89 HEADER-CH5-6.12
BUS51
  Top 0.3: 6J.TOP 105.5,30.29 arc45 106.2,31.98 106.2,39.01 arc45 105.5,40.7 103.8,42.4 arc45 102.11,43.1 98.49,43.1 arc-45 96.8,43.8 92.7,47.9 arc-45 92,49.59 92,85.4 96.8,90.2 arc-45 98.49,90.9 103,90.9 105.63,93.53 arc45 106.1,94.66 106.1,94.94 arc45 105.63,96.07 103.39,98.31 arc45 101.97,98.9 99.16,98.9 arc-45 97.18,99.72 92.92,103.98 arc-45 92.1,105.96 92.1,139.88 arc-45 93.04,142.14 96.76,145.86 arc-45 99.03,146.8 102.07,146.8 arc45 103.49,147.39 105.63,149.53 arc45 106.1,150.66 106.1,150.84 arc45 105.63,151.97 104.79,152.81 arc45 103.37,153.4 101.42,153.4 arc-45 99.16,154.34 93.3,160.2 arc-45 92.6,161.89 HEADER-CH5-6.10
BUS53
  Top 0.3: 6G.TOP 93.4,59.89 arc-45 92.7,61.58 92.7,84.17 arc-45 93.29,85.59 97.9,90.2 103.4,90.2 106.8,93.6 106.8,96 103.9,98.9 arc45 102.21,99.6 99.39,99.6 arc-45 97.7,100.3 93.5,104.5 arc-45 92.8,106.19 92.8,139.64 arc-45 93.62,141.62 97.28,145.28 arc-45 99.26,146.1 102.41,146.1 arc45 104.1,146.8 106.21,148.91 arc45 106.8,150.33 106.8,151.07 arc45 106.21,152.49 105.3,153.4 arc45 103.61,154.1 101.66,154.1 arc-45 99.68,154.92 95.3,159.3 arc-45 94.6,160.99 HEADER-CH5-6.8
BUS55  (5 unrouted)
  Top 0.3: HEADER-CH5-6.11 91.6,165.8 arc-90 92.6,166.8 97.6,166.8 | 97.6,166.8 101.79,166.8 arc-45 102.49,166.51 105.7,163.3 105.7,162 | HEADER-CH5-6.5 97.6,166.8
  pour Top: 105.7,160.4 arc-90 104.2,161.9 arc-90 105.7,163.4 arc-90 107.2,161.9 arc-90
BUS56
  Top 0.3: 6E.TOP 106.8,87.47 arc45 107.5,89.16 107.5,96.4 104.42,99.48 arc45 102.44,100.3 99.73,100.3 arc-45 98.31,100.89 94.09,105.11 arc-45 93.5,106.53 93.5,139.41 arc-45 94.2,141.1 97.8,144.7 arc-45 99.49,145.4 102.74,145.4 arc45 104.72,146.22 106.8,148.3 arc45 107.5,149.99 107.5,151.31 arc45 106.8,153 105.82,153.98 arc45 103.84,154.8 101.89,154.8 arc-45 100.2,155.5 97.3,158.4 arc-45 96.6,160.09 HEADER-CH5-6.6
BUS58
  Top 0.3: 6C.TOP 94.9,114.27 arc-45 94.2,115.96 94.2,139.17 arc-45 94.79,140.59 98.31,144.11 arc-45 99.73,144.7 103.08,144.7 arc45 105.34,145.64 107.38,147.68 arc45 108.2,149.66 108.2,151.54 arc45 107.38,153.52 106.34,154.56 arc45 104.08,155.5 102.13,155.5 arc-45 100.71,156.09 100.3,156.5 arc-45 99.6,158.19 HEADER-CH5-6.3
BUS60
  Top 0.3: 6A.TOP 107.96,144.51 arc45 108.9,146.78 108.9,151.78 arc45 107.96,154.04 102.3,159.7 arc-45 101.6,161.39 HEADER-CH5-6.1
BUS61
  Top 0.3: 7J.TOP 123.68,30.18 arc45 124.5,32.16 124.5,38.44 arc45 123.68,40.42 121.82,42.28 arc45 119.84,43.1 117.26,43.1 arc-45 115.28,43.92 112.82,46.38 arc-45 112,48.36 112,85.81 arc-45 112.7,87.5 115.4,90.2 arc-45 117.09,90.9 120.39,90.9 arc44 121.78,91.46 123.91,93.53 arc46 124.4,94.68 124.4,95.04 arc45 123.93,96.17 121.79,98.31 arc45 120.37,98.9 117.26,98.9 arc-45 115.28,99.72 111.22,103.78 arc-45 110.4,105.76 110.4,139.78 arc-45 111.34,142.04 115.16,145.86 arc-45 117.42,146.8 120.27,146.8 arc45 121.69,147.39 124.07,149.77 arc45 124.4,150.57 124.4,150.84 arc45 123.93,151.97 118.6,157.3 arc-45 117.9,158.99 HEADER-CH7_8.21
BUS63
  Top 0.3: 7G.TOP 113.52,58.06 arc-45 112.7,60.04 112.7,85.57 arc-45 113.29,86.99 115.91,89.61 arc-45 117.33,90.2 120.71,90.2 arc45 122.4,90.9 124.51,93.01 arc45 125.1,94.43 125.1,95.27 arc45 124.51,96.69 122.3,98.9 arc45 120.61,99.6 117.39,99.6 arc-45 115.7,100.3 111.8,104.2 arc-45 111.1,105.89 111.1,139.54 arc-45 111.92,141.52 115.68,145.28 arc-45 117.66,146.1 120.51,146.1 arc45 122.2,146.8 124.4,149 arc45 125.1,150.69 125.1,151.07 arc45 124.51,152.49 120.6,156.4 arc-45 119.9,158.09 HEADER-CH7_8.19
BUS65  (5 unrouted)
  Top 0.3: HEADER-CH7_8.16 122.9,165.8 arc90 121.9,166.8 116.9,166.8 | 116.9,166.8 116.71,166.8 arc45 116.01,166.51 112.8,163.3 112.8,162 | HEADER-CH7_8.22 116.9,166.8
  pour Top: 112.8,163.4 arc-90 114.3,161.9 arc-90 112.8,160.4 arc-90 111.3,161.9 arc-90
BUS66
  Top 0.3: 7E.TOP 125.1,87.48 arc45 125.8,89.17 125.8,95.51 arc45 125.1,97.2 122.82,99.48 arc45 120.84,100.3 117.63,100.3 arc-45 116.21,100.89 112.39,104.71 arc-45 111.8,106.13 111.8,139.31 arc-45 112.5,141 116.2,144.7 arc-45 117.89,145.4 120.74,145.4 arc45 122.72,146.22 124.98,148.48 arc45 125.8,150.46 125.8,151.31 arc45 125.1,153 122.6,155.5 arc-45 121.9,157.19 HEADER-CH7_8.17
BUS68
  Top 0.3: 7C.TOP 113.2,114.26 arc-45 112.5,115.95 112.5,139.07 arc-45 113.09,140.49 116.71,144.11 arc-45 118.13,144.7 120.88,144.7 arc45 123.14,145.64 125.68,148.18 arc45 126.5,150.16 126.5,151.64 arc45 125.68,153.62 125.6,153.7 arc-45 124.9,155.39 HEADER-CH7_8.14
BUS70
  Top 0.3: 7A.TOP 118.57,139.87 126.26,147.56 arc45 127.2,149.83 127.2,151.97 arc45 126.26,154.24 126.19,154.31 arc-45 125.6,155.73 125.6,158.76 arc-45 126.2,160.2 arc45 126.9,161.89 HEADER-CH7_8.12
BUS71
  Top 0.3: 8J.TOP 141.98,30.19 arc45 142.8,32.17 142.8,38.84 arc45 141.98,40.82 140.52,42.28 arc45 138.54,43.1 135.56,43.1 arc-45 133.58,43.92 130.92,46.58 arc-45 130.1,48.56 130.1,84.31 arc-45 130.8,86 135,90.2 arc-45 136.69,90.9 138.97,90.9 arc45 140.39,91.49 142.23,93.33 arc45 142.7,94.46 142.7,95.24 arc45 142.23,96.37 140.29,98.31 arc45 138.87,98.9 135.66,98.9 arc-45 133.68,99.72 129.52,103.88 arc-45 128.7,105.86 128.7,139.78 arc-45 129.64,142.04 133.46,145.86 arc-45 135.72,146.8 138.37,146.8 arc45 139.79,147.39 142.29,149.89 arc45 142.6,150.64 arc45 142.13,151.77 141.97,151.93 arc45 140.84,152.4 139.06,152.4 arc-45 137.08,153.22 129.6,160.7 arc-45 128.9,162.39 HEADER-CH7_8.10
BUS73
  Top 0.3: 8G.TOP 131.62,58.25 arc-45 130.8,60.23 130.8,84.07 arc-45 131.39,85.49 135.51,89.61 arc-45 136.93,90.2 139.21,90.2 arc45 140.9,90.9 142.81,92.81 arc45 143.4,94.23 143.4,95.47 arc45 142.81,96.89 140.8,98.9 arc45 139.11,99.6 135.79,99.6 arc-45 134.1,100.3 130.1,104.3 arc-45 129.4,105.99 129.4,139.64 arc-45 130.22,141.62 133.88,145.28 arc-45 135.86,146.1 138.51,146.1 arc45 140.2,146.8 142.71,149.31 arc45 143.3,150.73 143.3,150.87 arc45 142.71,152.29 142.49,152.51 arc45 141.07,153.1 139.29,153.1 arc-45 137.6,153.8 131.6,159.8 arc-45 130.9,161.49 HEADER-CH7_8.8
BUS75  (5 unrouted)
  Top 0.3: HEADER-CH7_8.11 127.9,165.8 arc-90 128.9,166.8 133.9,166.8 | 133.9,166.8 138.09,166.8 arc-45 138.79,166.51 142,163.3 142,161.9 | HEADER-CH7_8.5 133.9,166.8
  pour Top: 142,160.4 arc-90 140.5,161.9 arc-90 142,163.4 arc-90 143.5,161.9 arc-90
BUS76
  Top 0.3: 8E.TOP 143.28,87.37 arc45 144.1,89.35 144.1,95.54 arc45 143.28,97.52 141.32,99.48 arc45 139.34,100.3 135.93,100.3 arc-45 134.51,100.89 130.69,104.71 arc-45 130.1,106.13 130.1,139.51 arc-45 130.8,141.2 134.3,144.7 arc-45 135.99,145.4 138.64,145.4 arc45 140.62,146.22 143.3,148.9 arc45 144,150.59 144,151.11 arc45 143.3,152.8 143,153.1 arc45 141.31,153.8 139.53,153.8 arc-45 138.11,154.39 133.6,158.9 arc-45 132.9,160.59 HEADER-CH7_8.6
BUS78
  Top 0.3: 8C.TOP 131.74,114.01 arc-45 130.8,116.28 130.8,139.37 arc-45 131.39,140.79 134.71,144.11 arc-45 136.13,144.7 138.78,144.7 arc45 141.04,145.64 143.88,148.48 arc45 144.7,150.46 144.7,154.01 arc45 144,155.7 141.39,158.31 arc45 139.97,158.9 138.89,158.9 arc-45 137.2,159.6 136.6,160.2 arc-45 135.9,161.89 HEADER-CH7_8.3
BUS80
  Top 0.3: 8A.TOP 144.58,144.55 arc45 145.4,146.53 145.4,154.24 arc45 144.58,156.22 141.9,158.9 arc45 140.21,159.6 140.04,159.6 arc-45 138.6,160.2 arc-45 137.9,161.89 HEADER-CH7_8.1

### Text on the board
tPlace: Soundplane piezo-layer / V0.95 - R006 / (c) 2015 ICST